# Altium schematic sheet [01] SYSTEM_POWER.SchDoc (part 1 of 3)
size B; DocumentNumber: 01; SheetNumber: 01; SheetTotal: 3
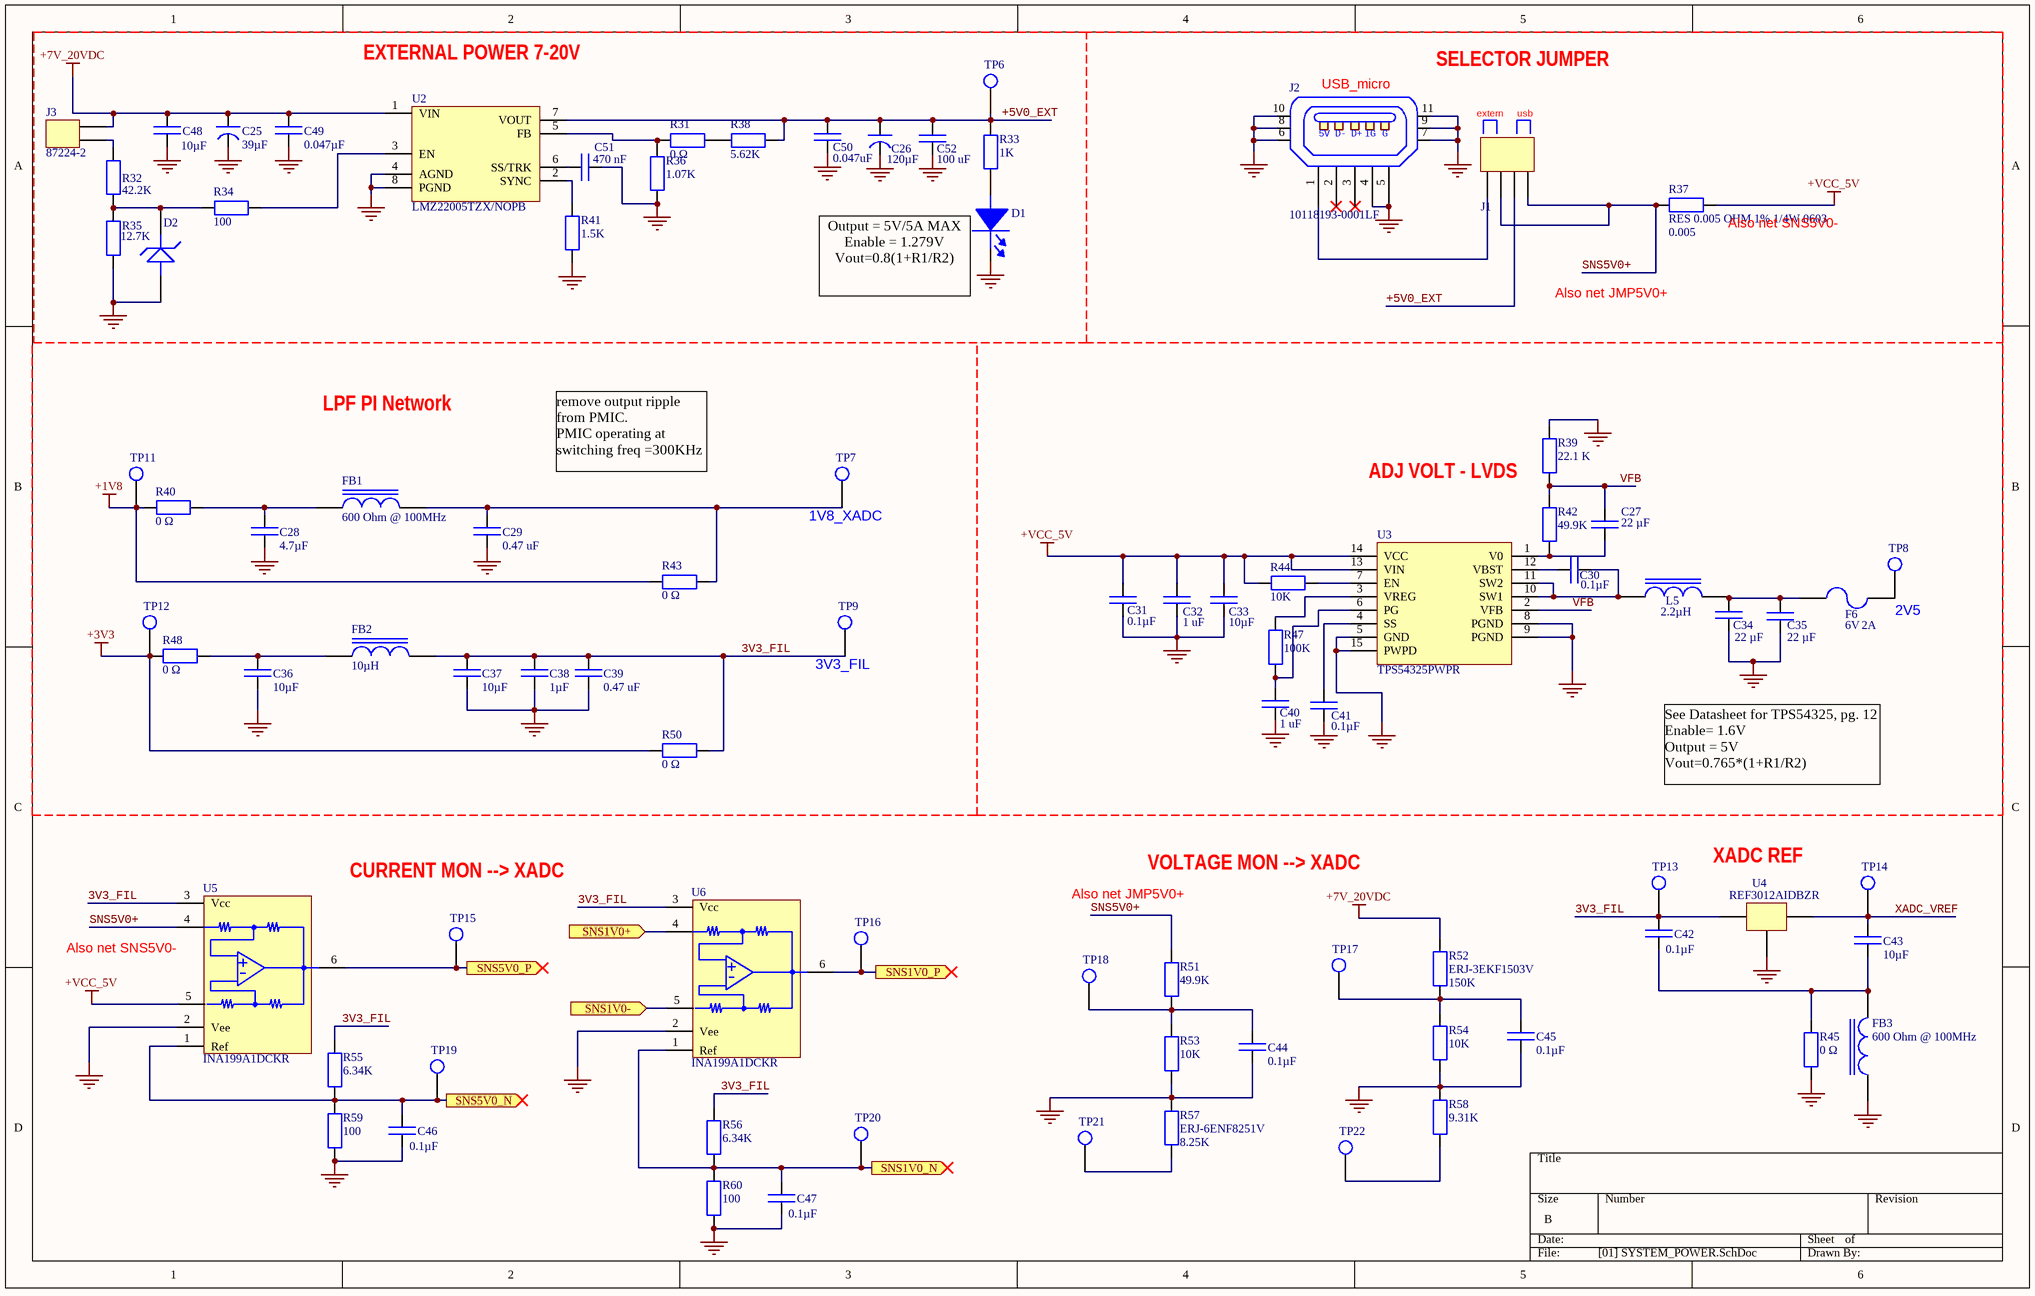
[diagram p0: [01] SYSTEM_POWER.SchDoc]

## Parts
C25  Capacitance: 39µF  [Radial E7]  (hidden comment: 35SVPF39M)
C26  Capacitance: 120µF  [Radial C6]  (hidden comment: 20SVPF120M)
C27  Capacitance: 22 µF  [C1206]  (hidden comment: 12063D226KAT2A)
C28  Capacitance: 4.7µF  [C0805_1]  (hidden comment: C2012X5R1C475K060AC)
C29  Capacitance: 0.47 uF  [C0603_1]  (hidden comment: GRM188R70J474KA01D)
C30  Capacitance: 0.1µF  [R0402]  (hidden comment: CC0402KRX7R6BB104)
C31  Capacitance: 0.1µF  [R0402]  (hidden comment: CC0402KRX7R6BB104)
C32  Capacitance: 1 uF  [C0603_1]  (hidden comment: C0603C105K8RACTU)
C33  Capacitance: 10µF  [C1206]  (hidden comment: C3216X5R1C106M160AA)
C34  Capacitance: 22 µF  [C1206]  (hidden comment: 12063D226KAT2A)
C35  Capacitance: 22 µF  [C1206]  (hidden comment: 12063D226KAT2A)
C36  Capacitance: 10µF  [C1206]  (hidden comment: C3216X5R1C106M160AA)
C37  Capacitance: 10µF  [C1206]  (hidden comment: C3216X5R1C106M160AA)
C38  Capacitance: 1µF  [C1206]  (hidden comment: C3216X7R1H105K160AE)
C39  Capacitance: 0.47 uF  [C0603_1]  (hidden comment: GRM188R70J474KA01D)
C40  Capacitance: 1 uF  [C0603_1]  (hidden comment: C0603C105K8RACTU)
C41  Capacitance: 0.1µF  [R0402]  (hidden comment: CC0402KRX7R6BB104)
C42  Capacitance: 0.1µF  [R0402]  (hidden comment: CC0402KRX7R6BB104)
C43  Capacitance: 10µF  [C1206]  (hidden comment: C3216X5R1C106M160AA)
C44  Capacitance: 0.1µF  [R0402]  (hidden comment: CC0402KRX7R6BB104)
C45  Capacitance: 0.1µF  [R0402]  (hidden comment: CC0402KRX7R6BB104)
C46  Capacitance: 0.1µF  [R0402]  (hidden comment: CC0402KRX7R6BB104)
C47  Capacitance: 0.1µF  [R0402]  (hidden comment: CC0402KRX7R6BB104)
C48  Capacitance: 10µF  [C0603_1]  (hidden comment: GRM188R6YA106MA73D)
C49  Minimum Quantity: 0.047µF  [C0603_1]  (hidden comment: GMK107BJ473KAHT)
C50  Capacitance Value: 0.047uF  [R0603]  (hidden comment: C0603C473K8RAC7867)
C51  Capacitance: 470 nF  [C0805_1]  (hidden comment: 0805YC474KAT2A)
C52  Capacitance Value: 100 uF  [C1206]  (hidden comment: GRM31CR60J107ME39K)
D1  SML-LXFP0603USBCTR  [LED-0603-BLUE]  (value not drawn)
D2  MMSZ5231BS-7-F  [SOD-323_R1]  (value not drawn)
F6  Voltage - Max: 6V  Current - Hold (Ih) (Max): 2A  [C1206 - PTC]  (hidden comment: MF-NSML200-2)
FB1  Impedance @ Frequency: 600 Ohm @ 100MHz  [R0805]  (hidden comment: FERRITE BEAD 600 OHM 0805 1LN)
FB2  Inductance: 10µH  [R0805]  (hidden comment: MLZ2012N100LT000)
FB3  Impedance @ Frequency: 600 Ohm @ 100MHz  [R0805]  (hidden comment: FERRITE BEAD 600 OHM 0805 1LN)
J1  PRPC004SAAN-RC  [HDR_MALE_1x4_2.54mm]  (value not drawn)
J2  10118193-0001LF  [USB_MICRO - duplicate]
J3  87224-2  [HDR_MALE_1x2_2.54mm]
L5  Inductance: 2.2µH  [2.2UH_10_7MMx10.4MM]  (hidden comment: SPM10040T-2R2M)
R31  Resistance: 0 Ω  [R0805]  (hidden comment: ERJ-6GEY0R00V)
R32  Resistance (Ohms): 42.2K  [R0603]  (hidden comment: ERJ-3EKF4222V)
R33  Resistance: 1K  [R0603]  (hidden comment: ERA-3AEB102V)
R34  Resistance: 100  [R0603]  (hidden comment: ERJ3EKF1000V)
R35  Resistance: 12.7K  [R0603]  (hidden comment: ERJ-3EKF1272V)
R36  Resistance (Ohms): 1.07K  [R0805]  (hidden comment: ERJ-6ENF1071V)
R37  RES 0.005 OHM 1% 1/4W 0603  Resistance (Ohms): 0.005  [R0603]
R38  Resistance: 5.62K  [R0805]  (hidden comment: ERJ-6ENF5621V)
R39  Resistance: 22.1 K  [R0603]  (hidden comment: ERJ-3EKF2212V)
R40  Resistance: 0 Ω  [R0805]  (hidden comment: ERJ-6GEY0R00V)
R41  Resistance: 1.5K  [R0603]  (hidden comment: ERJ-3EKF1501V)
R42  Resistance: 49.9K  [R0603]  (hidden comment: ERJ-3EKF4992V)
R43  Resistance: 0 Ω  [R0805]  (hidden comment: ERJ-6GEY0R00V)
R44  Resistance: 10K  [R0603]  (hidden comment: ERJ-3EKF1002V)
R45  Resistance: 0 Ω  [R0805]  (hidden comment: ERJ-6GEY0R00V)
R47  Resistance: 100K  [R0603]  (hidden comment: ERJ3EKF1003V)
R48  Resistance: 0 Ω  [R0805]  (hidden comment: ERJ-6GEY0R00V)
R50  Resistance: 0 Ω  [R0805]  (hidden comment: ERJ-6GEY0R00V)
R51  Resistance: 49.9K  [R0603]  (hidden comment: ERJ-3EKF4992V)
R52  ERJ-3EKF1503V  Resistance Value: 150K  [R0603]
R53  Resistance: 10K  [R0603]  (hidden comment: ERJ-3EKF1002V)
R54  Resistance: 10K  [R0603]  (hidden comment: ERJ-3EKF1002V)
R55  Resistance: 6.34K  [R0603]  (hidden comment: ERJ-3EKF6341V)
R56  Resistance: 6.34K  [R0603]  (hidden comment: ERJ-3EKF6341V)
R57  ERJ-6ENF8251V  Resistance: 8.25K  [R0805]
R58  Resistance: 9.31K  [R0603]  (hidden comment: ERJ-3EKF9311V)
R59  Resistance: 100  [R0603]  (hidden comment: ERJ3EKF1000V)
R60  Resistance: 100  [R0603]  (hidden comment: ERJ3EKF1000V)
TP6  5017  [TEST_POINT]  (value not drawn)
TP7  5017  [TEST_POINT]  (value not drawn)
TP8  5017  [TEST_POINT]  (value not drawn)
TP9  5017  [TEST_POINT]  (value not drawn)
TP11  5017  [TEST_POINT]  (value not drawn)
TP12  5017  [TEST_POINT]  (value not drawn)
TP13  5017  [TEST_POINT]  (value not drawn)
TP14  5017  [TEST_POINT]  (value not drawn)
TP15  5017  [TEST_POINT]  (value not drawn)
TP16  5017  [TEST_POINT]  (value not drawn)
TP17  5017  [TEST_POINT]  (value not drawn)
TP18  5017  [TEST_POINT]  (value not drawn)
TP19  5017  [TEST_POINT]  (value not drawn)
TP20  5017  [TEST_POINT]  (value not drawn)
TP21  5017  [TEST_POINT]  (value not drawn)
TP22  5017  [TEST_POINT]  (value not drawn)
U2  LMZ22005TZX/NOPB  [TO-PMOD-7]
U3  TPS54325PWPR  [14-HTSSOP]
U4  REF3012AIDBZR  [SOT-23-3]
U5  INA199A1DCKR  [SOT-363]
U6  INA199A1DCKR  [SOT-363]

## Blocks framed on the sheet
EXTERNAL POWER 7-20V: C25 C26 C48-C52 D1 D2 J3 R31-R36 R38 R41 TP6 U2

## Ports
SNS1V0+ (in, see 03), SNS1V0- (in, see 03), SNS1V0_N (out), SNS1V0_P (out), SNS5V0_N (out), SNS5V0_P (out)

## Nets
+1V8: R40.2 R43.2 TP11.1
+3V3: R48.2 R50.2 TP12.1
+7V_20VDC: C25.1 C48.2 C49.2 J3.2 R52.2 U2.1(VIN)
+VCC_5V: C31.1 C32.2 C33.2 R37.2 R44.1 U3.13(VIN) U3.14(VCC) U5.5(-)
GND: C25.2 C26.2 C28.1 C29.1 C31.2 C32.1 C33.1 C34.1 C35.1 C36.1 C37.1 C38.1 C39.1 C40.1 C41.2 C44.2 C45.2 C46.1 C47.1 C48.1 C49.1 C50.1 C51.1 C52.1 D1.2(CATHODE) D2.1 FB3.1 J2.4 J2.5 J2.6 J2.7 J2.8 J2.9 J2.10 J2.11 R35.1 R36.1 R39.2 R41.1 R45.2 R53.1 R54.1 R57.2 R58.2 R59.1 R60.1 U2.4(AGND) U2.8(PGND) U3.5(GND) U3.8(PGND) U3.9(PGND) U3.15(PWPD) U4.3 U5.2(Vee) U6.2(Vee)
3V3_FIL: C37.2 C38.2 C39.2 C42.2 FB2.2 R50.1 R55.2 R56.2 TP9.1 TP13.1 U4.1 U5.3(Vcc) U6.3(Vcc)
+5V0_EXT: C26.1 C50.2 C52.2 J1.3 R33.2 R38.2 TP6.1 U2.7(VOUT)
SNS1V0+: U6.4(+) ; port SNS1V0+
SNS1V0-: U6.5(-) ; port SNS1V0-
SNS1V0_N: C47.2 R56.1 R60.2 TP20.1 U6.1(Ref) ; port SNS1V0_N
SNS1V0_P: TP16.1 U6.6(OUT) ; port SNS1V0_P
SNS5V0+: J1.2 J1.4 R37.1 R51.2 U5.4(+)
SNS5V0_N: C46.2 R55.1 R59.2 TP19.1 U5.1(Ref) ; port SNS5V0_N
SNS5V0_P: TP15.1 U5.6(OUT) ; port SNS5V0_P
VFB: C27.2 R39.1 R42.2 U3.2(VFB)
XADC_VREF: C43.2 TP14.1 U4.2
NetC27_1: C27.1 R42.1 U3.1(V0)
NetC28_2: C28.2 FB1.1 R40.1
NetC29_2: C29.2 FB1.2 R43.1 TP7.1
NetC30_1: C30.1 U3.12(VBST)
NetC30_2: C30.2 L5.1 U3.10(SW1) U3.11(SW2)
NetC34_2: C34.2 C35.2 F6.1 L5.2
NetC36_2: C36.2 FB2.1 R48.1
NetC40_2: C40.2 R47.1 U3.6(PG)
NetC41_1: C41.1 U3.4(SS)
NetC42_1: C42.1 C43.1 FB3.2 R45.1
NetC44_1: C44.1 R51.1 R53.2 TP18.1
NetC45_1: C45.1 R52.1 R54.2 TP17.1
NetC51_2: C51.2 U2.6(SS/TRK)
NetD1_1: D1.1(ANODE) R33.1
NetD2_2: D2.2 R32.1 R34.1 R35.2
NetF6_2: F6.2 TP8.1
NetJ1_1: J1.1 J2.1
NetJ3_1: J3.1 R32.2
NetR31_1: R31.1 R38.1
NetR31_2: R31.2 R36.2 U2.5(FB)
NetR34_2: R34.2 U2.3(EN)
NetR41_2: R41.2 U2.2(SYNC)
NetR44_2: R44.2 U3.7(EN)
NetR47_2: R47.2 U3.3(VREG)
NetR57_1: R57.1 TP21.1
NetR58_1: R58.1 TP22.1

Not connected (* = marked no-connect by the designer): J2 2* 3*

## Notes on the sheet
- (near J2) USB_micro
- (near J2) SELECTOR JUMPER
- extern
- (near J1) usb
- (near R37) Also net SNS5V0-
- (near D1) Output = 5V/5A MAX
  Enable = 1.279V
  Vout=0.8(1+R1/R2)
- Also net JMP5V0+
- LPF PI Network
- remove output ripple from PMIC.
  PMIC operating at switching freq =300KHz
- ADJ VOLT - LVDS
- (near TP7) 1V8_XADC
- 2V5
- (near TP9) 3V3_FIL
- See Datasheet for TPS54325, pg. 12
  Enable= 1.6V
  Output = 5V
  Vout=0.765*(1+R1/R2)
- CURRENT MON --> XADC
- VOLTAGE MON --> XADC
- XADC REF
- (near U5) Also net SNS5V0-
- (in symbol 10118193-0001LF_1) 5V; D-; D+; IG; G